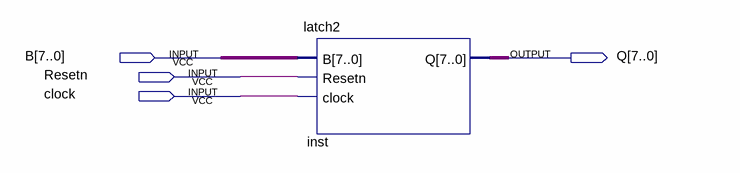
[diagram p0: schematic sheet]
// Quartus schematic Latch2Schem.bdf as structural Verilog: 1 symbols, 4 pins
module Latch2Schem (
  input  [7:0] B,
  input  Resetn,
  input  clock,
  output [7:0] Q
);

  latch2 inst (.B(B), .clock(clock), .Resetn(Resetn), .Q(Q));
endmodule
